# Altium schematic sheet TP_IHM_CONNECTOR.SchDoc
size A4
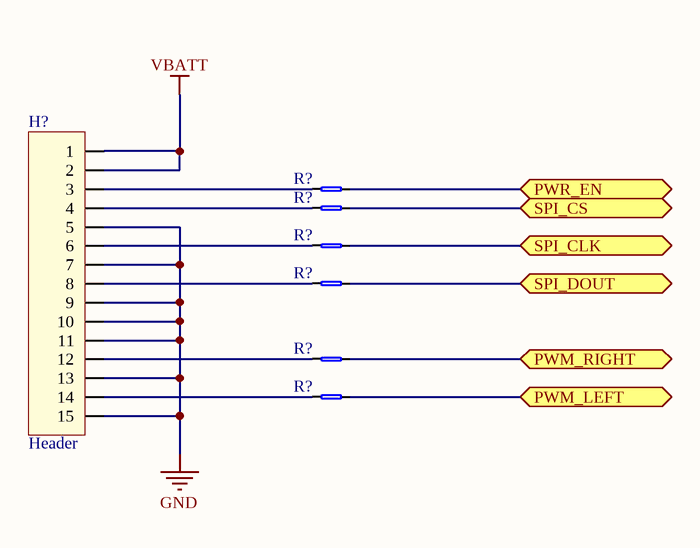
[diagram p0: TP_IHM_CONNECTOR.SchDoc]

## Parts
(Parts that share a designator on the sheet are numbered #1, #2 ... from top to bottom, then left to right.)
H?  Header  [653115131822]
R?#1  Resistor  [0402_RES_LD]  (value not drawn)
R?#2  Resistor  [0402_RES_LD]  (value not drawn)
R?#3  Resistor  [0402_RES_LD]  (value not drawn)
R?#4  Resistor  [0402_RES_LD]  (value not drawn)
R?#5  Resistor  [0402_RES_LD]  (value not drawn)
R?#6  Resistor  [0402_RES_LD]  (value not drawn)

## Ports
PWM_LEFT, PWM_RIGHT, PWR_EN, SPI_CLK, SPI_CS, SPI_DOUT

## Nets
GND: H?.5 H?.7 H?.9 H?.10 H?.11 H?.13 H?.15
VBATT: H?.1 H?.2
PWM_LEFT: R?#6.2 ; port PWM_LEFT
PWM_RIGHT: R?#5.2 ; port PWM_RIGHT
PWR_EN: R?#1.2 ; port PWR_EN
SPI_CLK: R?#3.2 ; port SPI_CLK
SPI_CS: R?#2.2 ; port SPI_CS
SPI_DOUT: R?#4.2 ; port SPI_DOUT
NetH?_3: H?.3 R?#1.1
NetH?_4: H?.4 R?#2.1
NetH?_6: H?.6 R?#3.1
NetH?_8: H?.8 R?#4.1
NetH?_12: H?.12 R?#5.1
NetH?_14: H?.14 R?#6.1

## Library data of the parts
H? = HEADER_15x1: Header 15x1
R?#1-R?#6 = Resistor: Value: 10k; Precision: *; Package: *